# EAGLE schematic PIC18F4520_2 (EAGLE 7.7.0)
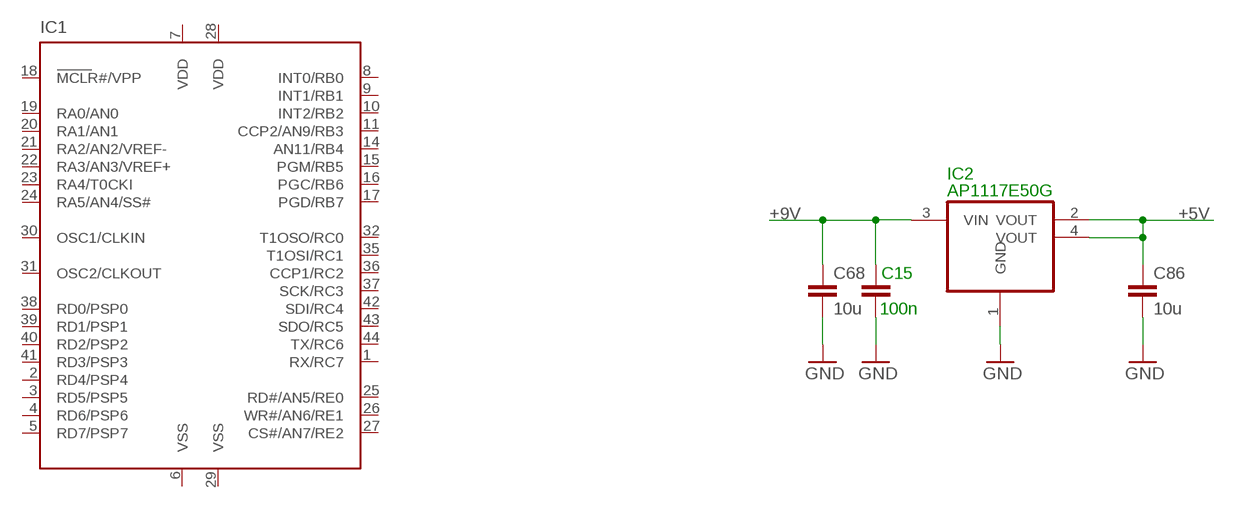
[diagram p0: schematic, sheet 1]

## Parts
C15  100n  C-EUC0805  [C0805]
C68  10u  C-EUC0805  [C0805]
C86  10u  C-EUC0805  [C0805]
IC1  PIC18F4520  [TQFP44]
IC2  AP1117E50G  REG1117-2OUT  [SOT223]

## Nets
+5V: C86.1 IC2.2(VOUT) IC2.4(VOUT)
+9V: C15.1 C68.1 IC2.3(VIN)
GND: C15.2 C68.2 C86.2 IC2.1(GND)
Unconnected: IC1.1(RX/RC7) IC1.2(RD4/PSP4) IC1.3(RD5/PSP5) IC1.4(RD6/PSP6) IC1.5(RD7/PSP7) IC1.6(VSS) IC1.7(VDD) IC1.8(INT0/RB0) IC1.9(INT1/RB1) IC1.10(INT2/RB2) IC1.11(CCP2/AN9/RB3) IC1.14(AN11/RB4) IC1.15(PGM/RB5) IC1.16(PGC/RB6) IC1.17(PGD/RB7) IC1.18(MCLR#/VPP) IC1.19(RA0/AN0) IC1.20(RA1/AN1) IC1.21(RA2/AN2/VREF-) IC1.22(RA3/AN3/VREF+) IC1.23(RA4/T0CKI) IC1.24(RA5/AN4/SS#) IC1.25(RD#/AN5/RE0) IC1.26(WR#/AN6/RE1) IC1.27(CS#/AN7/RE2) IC1.28(VDD) IC1.29(VSS) IC1.30(OSC1/CLKIN) IC1.31(OSC2/CLKOUT) IC1.32(T1OSO/RC0) IC1.35(T1OSI/RC1) IC1.36(CCP1/RC2) IC1.37(SCK/RC3) IC1.38(RD0/PSP0) IC1.39(RD1/PSP1) IC1.40(RD2/PSP2) IC1.41(RD3/PSP3) IC1.42(SDI/RC4) IC1.43(SDO/RC5) IC1.44(TX/RC6)

## Library data of the parts
C15 = rcl_416:C-EU: CAPACITOR, European symbol
C68 C86 = rcl:C-EU: CAPACITOR, European symbol
IC1 = Bernd:PIC18F4520
IC2 = Bernd_110428:REG1117-2OUT: 800mA and 1A Low Dropout (LDO) Positive Regulator 1.8V, 2.5V, 2.85V, 3.3V, 5V, and Adj